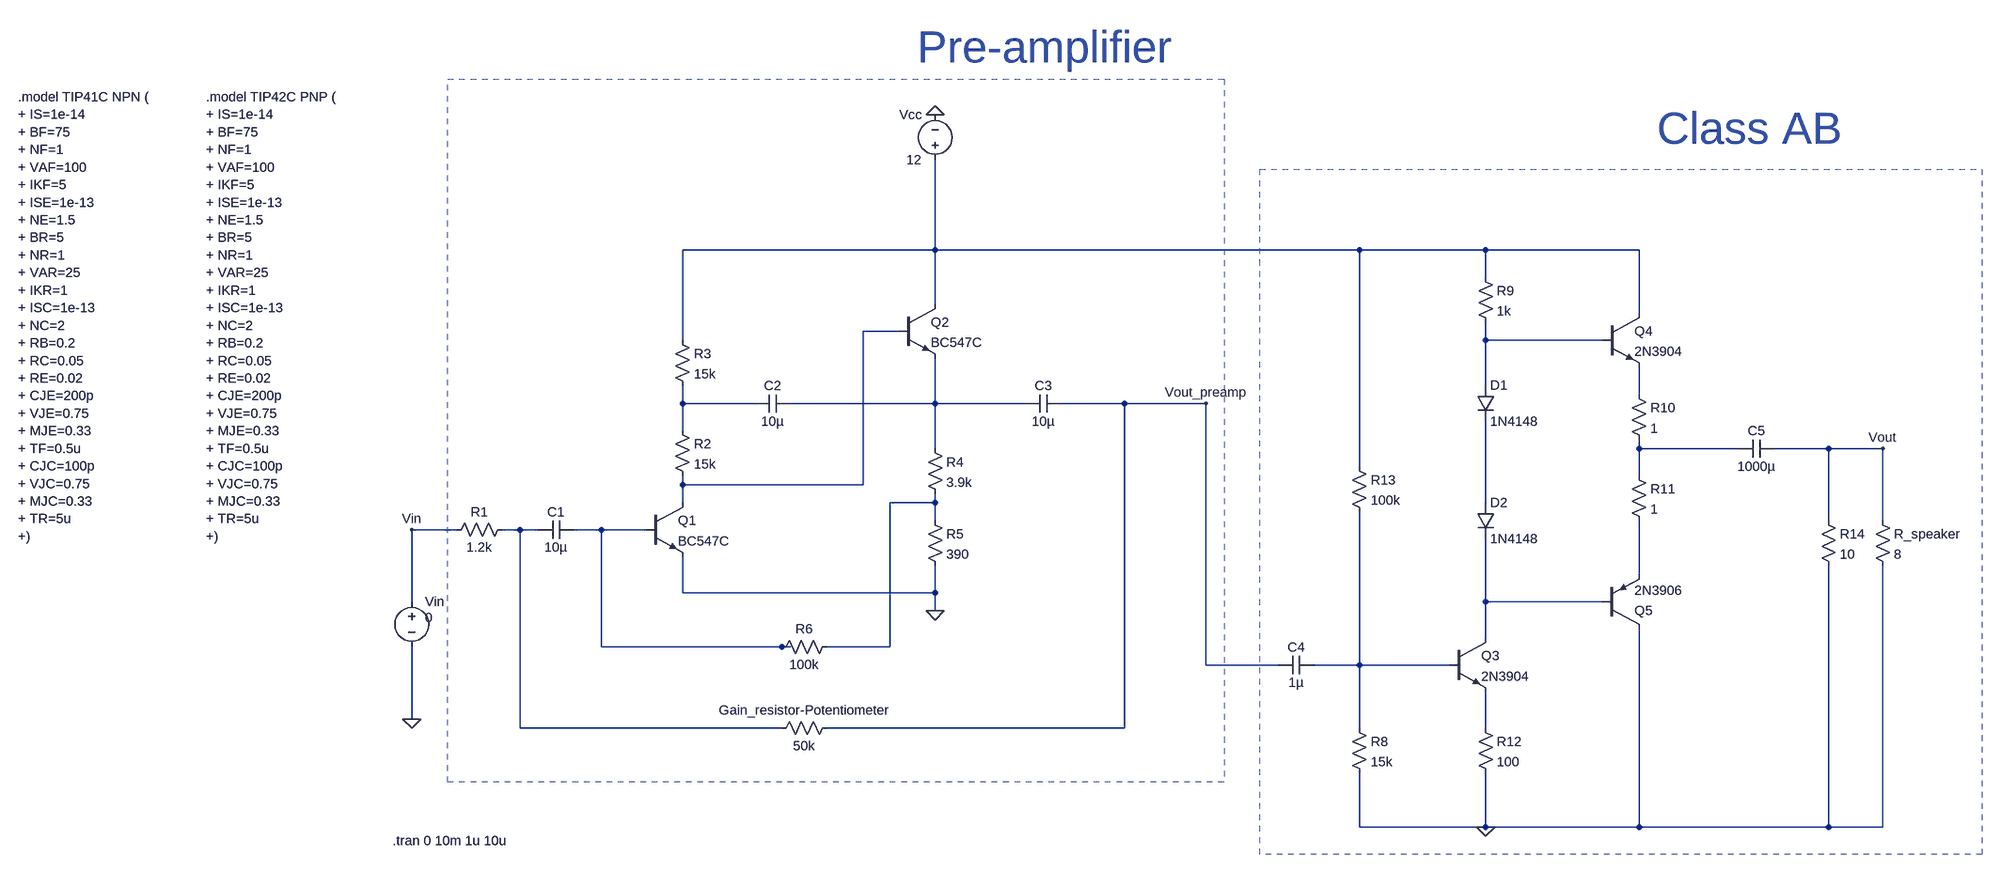
[diagram p0: schematic amplifier.asc]
amplifier.asc, the LTspice schematic file:
Version 4
SHEET 1 2820 756
WIRE 960 -320 960 -480
WIRE 960 -320 512 -320
WIRE 1712 -320 960 -320
WIRE 1936 -320 1712 -320
WIRE 2208 -320 1936 -320
WIRE 1936 -272 1936 -320
WIRE 960 -224 960 -320
WIRE 2208 -208 2208 -320
WIRE 896 -176 832 -176
WIRE 512 -160 512 -320
WIRE 1936 -160 1936 -192
WIRE 2144 -160 1936 -160
WIRE 1936 -80 1936 -160
WIRE 2208 -64 2208 -112
WIRE 512 -48 512 -80
WIRE 640 -48 512 -48
WIRE 960 -48 960 -128
WIRE 960 -48 704 -48
WIRE 1120 -48 960 -48
WIRE 1296 -48 1184 -48
WIRE 1440 -48 1296 -48
WIRE 512 0 512 -48
WIRE 960 32 960 -48
WIRE 2208 32 2208 16
WIRE 2384 32 2208 32
WIRE 2544 32 2448 32
WIRE 2640 32 2544 32
WIRE 1712 64 1712 -320
WIRE 2208 80 2208 32
WIRE 512 96 512 80
WIRE 832 96 832 -176
WIRE 832 96 512 96
WIRE 512 128 512 96
WIRE 960 128 960 112
WIRE 960 128 880 128
WIRE 1936 128 1936 -16
WIRE 960 160 960 128
WIRE 2544 160 2544 32
WIRE 2640 160 2640 32
WIRE 112 176 32 176
WIRE 224 176 192 176
WIRE 256 176 224 176
WIRE 368 176 320 176
WIRE 448 176 368 176
WIRE 2208 256 2208 160
WIRE 512 288 512 224
WIRE 960 288 960 240
WIRE 960 288 512 288
WIRE 32 304 32 176
WIRE 1936 304 1936 192
WIRE 2144 304 1936 304
WIRE 960 320 960 288
WIRE 1936 368 1936 304
WIRE 368 384 368 176
WIRE 688 384 368 384
WIRE 704 384 688 384
WIRE 880 384 880 128
WIRE 880 384 768 384
WIRE 1440 416 1440 -48
WIRE 1568 416 1440 416
WIRE 1712 416 1712 144
WIRE 1712 416 1632 416
WIRE 1872 416 1712 416
WIRE 32 512 32 384
WIRE 224 528 224 176
WIRE 688 528 224 528
WIRE 1296 528 1296 -48
WIRE 1296 528 768 528
WIRE 1712 528 1712 416
WIRE 1936 528 1936 464
WIRE 1712 704 1712 608
WIRE 1936 704 1936 608
WIRE 1936 704 1712 704
WIRE 2208 704 2208 352
WIRE 2208 704 1936 704
WIRE 2544 704 2544 240
WIRE 2544 704 2208 704
WIRE 2640 704 2640 240
WIRE 2640 704 2544 704
FLAG 960 320 0
FLAG 960 -560 0
FLAG 32 512 0
FLAG 1936 704 0
FLAG 2640 32 Vout
FLAG 1440 -48 Vout_preamp
FLAG 32 176 Vin
SYMBOL res 208 160 R90
WINDOW 0 0 56 VBottom 2
WINDOW 3 32 56 VTop 2
SYMATTR InstName R1
SYMATTR Value 1.2k
SYMBOL cap 320 160 R90
WINDOW 0 0 32 VBottom 2
WINDOW 3 32 32 VTop 2
SYMATTR InstName C1
SYMATTR Value 10µ
SYMBOL npn 448 128 R0
SYMATTR InstName Q1
SYMATTR Value BC547C
SYMBOL res 496 -16 R0
SYMATTR InstName R2
SYMATTR Value 15k
SYMBOL res 496 -176 R0
SYMATTR InstName R3
SYMATTR Value 15k
SYMBOL cap 704 -64 R90
WINDOW 0 0 32 VBottom 2
WINDOW 3 32 32 VTop 2
SYMATTR InstName C2
SYMATTR Value 10µ
SYMBOL npn 896 -224 R0
SYMATTR InstName Q2
SYMATTR Value BC547C
SYMBOL res 944 16 R0
SYMATTR InstName R4
SYMATTR Value 3.9k
SYMBOL res 944 144 R0
SYMATTR InstName R5
SYMATTR Value 390
SYMBOL res 784 368 R90
WINDOW 0 0 56 VBottom 2
WINDOW 3 32 56 VTop 2
SYMATTR InstName R6
SYMATTR Value 100k
SYMBOL res 784 512 R90
WINDOW 0 0 56 VBottom 2
WINDOW 3 32 56 VTop 2
SYMATTR InstName Gain_resistor-Potentiometer
SYMATTR Value 50k
SYMBOL cap 1184 -64 R90
WINDOW 0 0 32 VBottom 2
WINDOW 3 32 32 VTop 2
SYMATTR InstName C3
SYMATTR Value 10µ
SYMBOL voltage 960 -464 R180
WINDOW 0 24 96 Left 2
WINDOW 3 24 16 Left 2
WINDOW 123 0 0 Left 0
WINDOW 39 0 0 Left 0
SYMATTR InstName Vcc
SYMATTR Value 12
SYMBOL voltage 32 288 R0
WINDOW 123 0 0 Left 0
WINDOW 39 0 0 Left 0
WINDOW 3 24 44 Left 2
SYMATTR InstName Vin
SYMATTR Value 0
SYMBOL res 1920 -288 R0
SYMATTR InstName R9
SYMATTR Value 1k
SYMBOL npn 2144 -208 R0
SYMATTR InstName Q4
SYMATTR Value 2N3904
SYMBOL res 2192 -80 R0
SYMATTR InstName R10
SYMATTR Value 1
SYMBOL res 2192 64 R0
SYMATTR InstName R11
SYMATTR Value 1
SYMBOL diode 1920 -80 R0
SYMATTR InstName D1
SYMATTR Value 1N4148
SYMBOL diode 1920 128 R0
SYMATTR InstName D2
SYMATTR Value 1N4148
SYMBOL npn 1872 368 R0
SYMATTR InstName Q3
SYMATTR Value 2N3904
SYMBOL res 1920 512 R0
SYMATTR InstName R12
SYMATTR Value 100
SYMBOL cap 1632 400 R90
WINDOW 0 0 32 VBottom 2
WINDOW 3 32 32 VTop 2
SYMATTR InstName C4
SYMATTR Value 1µ
SYMBOL res 1696 512 R0
SYMATTR InstName R8
SYMATTR Value 15k
SYMBOL res 1696 48 R0
SYMATTR InstName R13
SYMATTR Value 100k
SYMBOL pnp 2144 352 M180
SYMATTR InstName Q5
SYMATTR Value 2N3906
SYMBOL cap 2448 16 R90
WINDOW 0 0 32 VBottom 2
WINDOW 3 32 32 VTop 2
SYMATTR InstName C5
SYMATTR Value 1000µ
SYMBOL res 2528 144 R0
SYMATTR InstName R14
SYMATTR Value 10
SYMBOL res 2624 144 R0
SYMATTR InstName R_speaker
SYMATTR Value 8
TEXT -2 728 Left 2 !.tran 0 10m 1u 10u
TEXT 928 -680 Left 6 ;Pre-amplifier
TEXT 2240 -536 Left 6 ;Class AB
TEXT -696 -592 Left 2 !.model TIP41C NPN (\n+ IS=1e-14\n+ BF=75\n+ NF=1\n+ VAF=100\n+ IKF=5\n+ ISE=1e-13\n+ NE=1.5\n+ BR=5\n+ NR=1\n+ VAR=25\n+ IKR=1\n+ ISC=1e-13\n+ NC=2\n+ RB=0.2\n+ RC=0.05\n+ RE=0.02\n+ CJE=200p\n+ VJE=0.75\n+ MJE=0.33\n+ TF=0.5u\n+ CJC=100p\n+ VJC=0.75\n+ MJC=0.33\n+ TR=5u\n+)
TEXT -344 -592 Left 2 !.model TIP42C PNP (\n+ IS=1e-14\n+ BF=75\n+ NF=1\n+ VAF=100\n+ IKF=5\n+ ISE=1e-13\n+ NE=1.5\n+ BR=5\n+ NR=1\n+ VAR=25\n+ IKR=1\n+ ISC=1e-13\n+ NC=2\n+ RB=0.2\n+ RC=0.05\n+ RE=0.02\n+ CJE=200p\n+ VJE=0.75\n+ MJE=0.33\n+ TF=0.5u\n+ CJC=100p\n+ VJC=0.75\n+ MJC=0.33\n+ TR=5u\n+)
RECTANGLE Normal 1472 624 96 -624 2
RECTANGLE Normal 2816 752 1536 -464 2

The netlist it stands for:
* amplifier.asc
R1 N010 Vin 1.2k
C1 N011 N010 10µ
Q1 N002 N011 0 0 BC547C
R2 N005 N002 15k
R3 N001 N005 15k
C2 N006 N005 10µ
Q2 N001 N002 N006 0 BC547C
R4 N006 N008 3.9k
R5 N008 0 390
R6 N008 N011 100k
R§Gain_resistor-Potentiometer Vout_preamp N010 50k
C3 Vout_preamp N006 10µ
Vcc N001 0 12
Vin Vin 0 0
R9 N001 N003 1k
Q4 N001 N003 N004 0 2N3904
R10 N004 N007 1
R11 N007 N012 1
D1 N003 N009 1N4148
D2 N009 N013 1N4148
Q3 N013 N014 N015 0 2N3904
R12 N015 0 100
C4 N014 Vout_preamp 1µ
R8 N014 0 15k
R13 N001 N014 100k
Q5 0 N013 N012 0 2N3906
C5 Vout N007 1000µ
R14 Vout 0 10
R_speaker Vout 0 8
.model D D
.lib standard.dio
.model NPN NPN
.model PNP PNP
.lib standard.bjt
.tran 0 10m 1u 10u
* Pre-amplifier
* Class AB
.model TIP41C NPN (
+ IS=1e-14
+ BF=75
+ NF=1
+ VAF=100
+ IKF=5
+ ISE=1e-13
+ NE=1.5
+ BR=5
+ NR=1
+ VAR=25
+ IKR=1
+ ISC=1e-13
+ NC=2
+ RB=0.2
+ RC=0.05
+ RE=0.02
+ CJE=200p
+ VJE=0.75
+ MJE=0.33
+ TF=0.5u
+ CJC=100p
+ VJC=0.75
+ MJC=0.33
+ TR=5u
+)
.model TIP42C PNP (
+ IS=1e-14
+ BF=75
+ NF=1
+ VAF=100
+ IKF=5
+ ISE=1e-13
+ NE=1.5
+ BR=5
+ NR=1
+ VAR=25
+ IKR=1
+ ISC=1e-13
+ NC=2
+ RB=0.2
+ RC=0.05
+ RE=0.02
+ CJE=200p
+ VJE=0.75
+ MJE=0.33
+ TF=0.5u
+ CJC=100p
+ VJC=0.75
+ MJC=0.33
+ TR=5u
+)
.backanno
.end